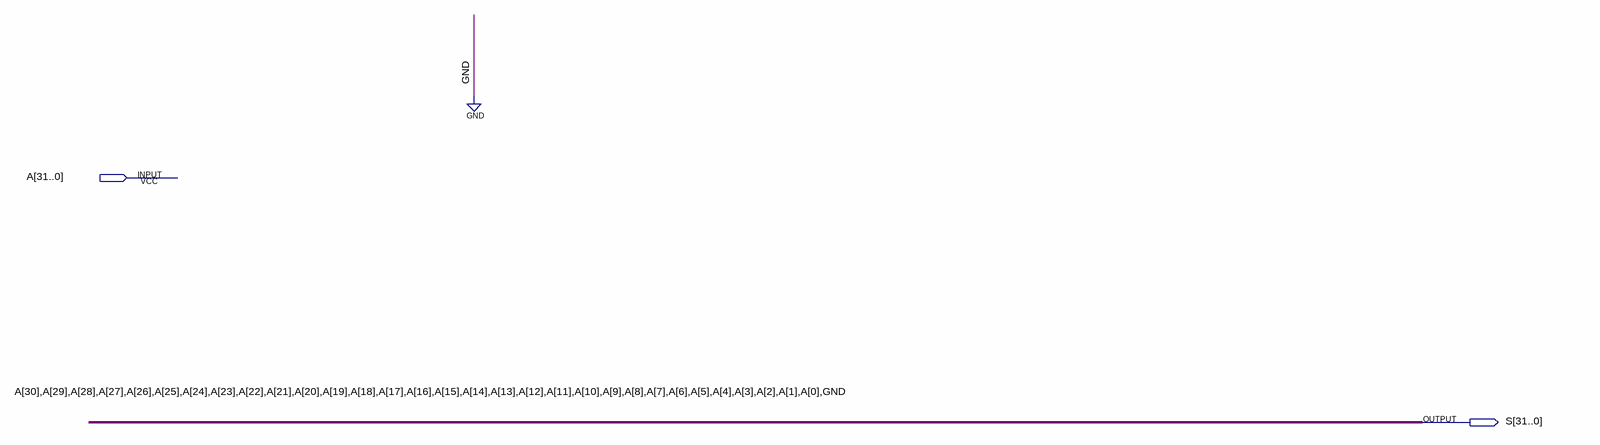
[diagram p0: schematic sheet]
// Quartus schematic SL1.bdf as structural Verilog: 0 symbols, 2 pins
module SL1 (
  input  [31:0] A,
  output [31:0] S
);


  assign S = {A[30:0], 1'b0};
endmodule
